# Altium project NixieClock_V1.PrjPCB
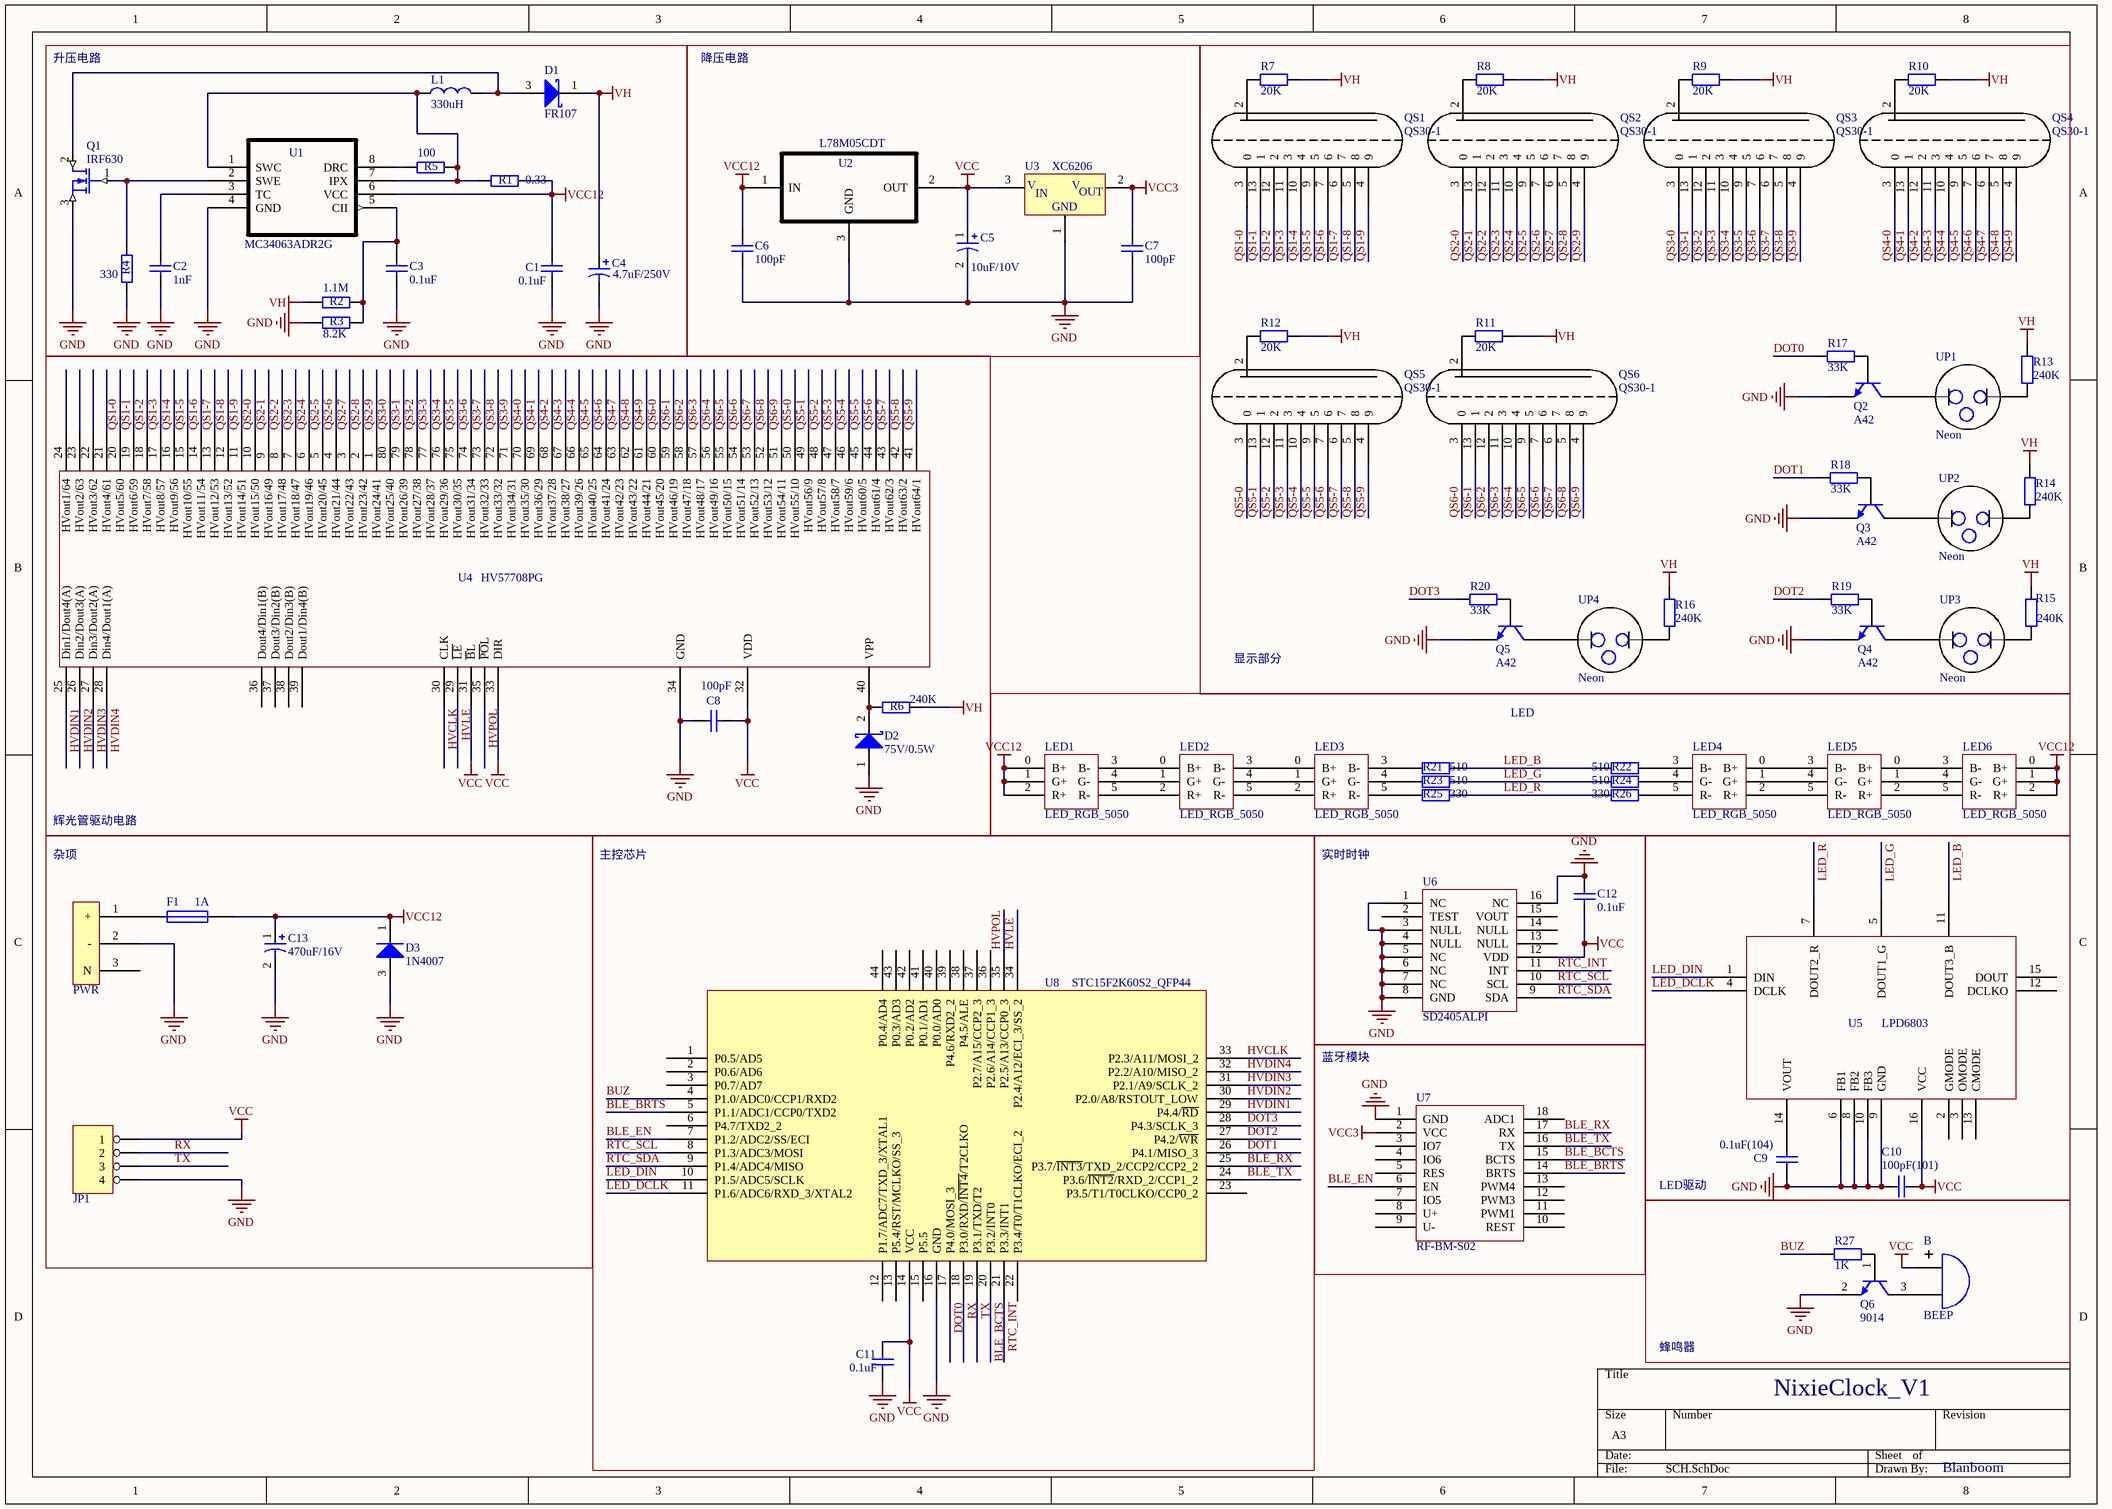
[diagram p0: SCH.SchDoc]
1 sheet, 78 parts. Net scope: global (net labels, ports and power ports of the same name join across sheets).
Board file: PCB.PcbDoc

## Sheet SCH.SchDoc
size A3; PageSetup: Record=PageOptions|CenterHorizontal=True|CenterVertical=True|PrintScale=1.00|XCorrection=1.00|YCorrection=1.00|PrintKind=1|BorderSize=5000000|LeftOffset=0|BottomOffset=0|Orientation=2|PaperLength=1000|PaperWidth=1000|Scale=100|PaperSource=7|PrintQuality=-4|MediaType=1|DitherType=10|PrintScaleMode=1|PaperKind=16K 197x273 mm|PaperIndex=121

### Parts
B  BEEP  [BEEP]
C1  value 0.1uF  [0805]  (hidden comment: Cap)
C2  value 1nF  [0805]  (hidden comment: Cap)
C3  value 0.1uF  [0805]  (hidden comment: Cap)
C4  value 4.7uF/250V  [1812]  (hidden comment: Cap Pol3)
C5  value 10uF/10V  [1206_Diode]  (hidden comment: Cap Pol1)
C6  value 100pF  [0805]  (hidden comment: Cap)
C7  value 100pF  [0805]  (hidden comment: Cap)
C8  value 100pF  [0805]  (hidden comment: Cap)
C9  value 0.1uF(104)  [0805]  (hidden comment: Cap)
C10  value 100pF(101)  [0805]  (hidden comment: Cap)
C11  value 0.1uF  [0805]  (hidden comment: Cap)
C12  value 0.1uF  [0805]  (hidden comment: Cap)
C13  value 470uF/16V  [7343]  (hidden comment: Cap Pol1)
D1  FR107  [DO-214AC]
D2  75V/0.5W  [1206_Diode]
D3  1N4007  [DO-214AC]
F1  1A  [1206]
JP1  Header4  [HEADER4]  (value not drawn)
L1  330uH  [330uH]
LED1  LED_RGB_5050  [LED_RGB_5050]
LED2  LED_RGB_5050  [LED_RGB_5050]
LED3  LED_RGB_5050  [LED_RGB_5050]
LED4  LED_RGB_5050  [LED_RGB_5050]
LED5  LED_RGB_5050  [LED_RGB_5050]
LED6  LED_RGB_5050  [LED_RGB_5050]
PWR  PWR  [DC-044]  (value not drawn)
Q1  IRF630  [TO-263]
Q2  A42  [SOT-23-BJT]
Q3  A42  [SOT-23-BJT]
Q4  A42  [SOT-23-BJT]
Q5  A42  [SOT-23-BJT]
Q6  9014  [SOT-23-BJT]
QS1  QS30-1  [QS30-1]
QS2  QS30-1  [QS30-1]
QS3  QS30-1  [QS30-1]
QS4  QS30-1  [QS30-1]
QS5  QS30-1  [QS30-1]
QS6  QS30-1  [QS30-1]
R1  value 0.33  [0805]  (hidden comment: Res2)
R2  value 1.1M  [0805]  (hidden comment: Res2)
R3  value 8.2K  [0805]  (hidden comment: Res2)
R4  value 330  [0805]  (hidden comment: Res2)
R5  value 100  [0805]  (hidden comment: Res2)
R6  value 240K  [0805]  (hidden comment: Res2)
R7  value 20K  [0805]  (hidden comment: Res2)
R8  value 20K  [0805]  (hidden comment: Res2)
R9  value 20K  [0805]  (hidden comment: Res2)
R10  value 20K  [0805]  (hidden comment: Res2)
R11  value 20K  [0805]  (hidden comment: Res2)
R12  value 20K  [0805]  (hidden comment: Res2)
R13  value 240K  [0805]  (hidden comment: Res2)
R14  value 240K  [0805]  (hidden comment: Res2)
R15  value 240K  [0805]  (hidden comment: Res2)
R16  value 240K  [0805]  (hidden comment: Res2)
R17  value 33K  [0805]  (hidden comment: Res2)
R18  value 33K  [0805]  (hidden comment: Res2)
R19  value 33K  [0805]  (hidden comment: Res2)
R20  value 33K  [0805]  (hidden comment: Res2)
R21  value 510  [0805]  (hidden comment: Res2)
R22  value 510  [0805]  (hidden comment: Res2)
R23  value 510  [0805]  (hidden comment: Res2)
R24  value 510  [0805]  (hidden comment: Res2)
R25  value 330  [0805]  (hidden comment: Res2)
R26  value 330  [0805]  (hidden comment: Res2)
R27  value 1K  [0805]  (hidden comment: Res2)
U1  MC34063ADR2G  [SO-8-M]
U2  L78M05CDT  [DPAK-M]
U3  XC6206  [SOT-23]
U4  HV57708PG  [PQFP80]
U5  LPD6803  [SO-16]
U6  SD2405ALPI  [DIP16]
U7  RF-BM-S02  [RF-BM-S02]
U8  STC15F2K60S2_QFP44  [LQFP44]
UP1  Neon  [Neon]
UP2  Neon  [Neon]
UP3  Neon  [Neon]
UP4  Neon  [Neon]

### Blocks framed on the sheet
升压电路: C1-C4 D1 L1 Q1 R1-R5 U1
降压电路: C5-C7 U2 U3
显示部分: Q2-Q5 QS1-QS6 R7-R20 UP1-UP4
辉光管驱动电路: C8 D2 R6 U4
LED: LED1-LED6 R21-R26
主控芯片: C11 U8
实时时钟: C12 U6
LED驱动: C9 C10 U5
蓝牙模块: U7

### Nets
GND: C1.1 C2.1 C3.1 C4.2 C5.2 C6.1 C7.1 C8.1 C9.1 C10.1 C11.2 C12.2 C13.2 D2.1(A) D3.3(A) JP1.4 PWR.2(-) Q1.3(S) Q2.2(E) Q3.2(E) Q4.2(E) Q5.2(E) Q6.2(E) R3.1 R4.1 U1.4(GND) U2.3(GND) U3.1(GND) U4.34(GND) U5.6(FB1) U5.8(FB2) U5.9(GND) U5.10(FB3) U6.1(NC) U6.3(NULL) U6.4(NULL) U6.5(NC) U6.6(NC) U6.7(NC) U6.8(GND) U6.16(NC) U7.1(GND) U8.16(GND)
VCC: B.1(A) C5.1 C8.2 C10.2 C11.1 C12.1 JP1.1 U2.2(OUT) U3.3(VIN) U4.31(~{B}L) U4.32(VDD) U4.33(DIR) U5.16(VCC) U6.12(VDD) U8.14(VCC)
VCC3: C7.2 U3.2(VOUT) U7.2(VCC)
VCC12: C1.2 C6.2 C13.1 D3.1(K) F1.2 LED1.0(B+) LED1.1(G+) LED1.2(R+) LED6.0(B+) LED6.1(G+) LED6.2(R+) R1.2 U1.6(VCC) U2.1(IN)
VH: C4.1 D1.1(K) R2.1 R6.2 R7.2 R8.2 R9.2 R10.2 R11.2 R12.2 R13.1 R14.1 R15.1 R16.1
BLE_BCTS: U7.15(BCTS) U8.20(P3.2/INT0)
BLE_BRTS: U7.14(BRTS) U8.5(P1.1/ADC1/CCP0/TXD2)
BLE_EN: U7.6(EN) U8.7(P1.2/ADC2/SS/ECI)
BLE_RX: U7.17(RX) U8.25(P3.7/~{INT3}/TXD_2/CCP2/CCP2_2)
BLE_TX: U7.16(TX) U8.24(P3.6/~{INT2}/RXD_2/CCP1_2)
BUZ: R27.1 U8.4(P1.0/ADC0/CCP1/RXD2)
DOT0: R17.1 U8.17(P4.0/MOSI_3)
DOT1: R18.1 U8.26(P4.1/MISO_3)
DOT2: R19.1 U8.27(P4.2/~{WR})
DOT3: R20.1 U8.28(P4.3/SCLK_3)
HVCLK: U4.30(CLK) U8.33(P2.3/A11/MOSI_2)
HVDIN1: U4.25(Din1/Dout4(A)) U8.29(P4.4/~{RD})
HVDIN2: U4.26(Din2/Dout3(A)) U8.30(P2.0/A8/RSTOUT_LOW)
HVDIN3: U4.27(Din3/Dout2(A)) U8.31(P2.1/A9/SCLK_2)
HVDIN4: U4.28(Din4/Dout1(A)) U8.32(P2.2/A10/MISO_2)
HVLE: U4.29(~{LE}) U8.34(P2.4/A12/ECI_3/SS_2)
HVPOL: U4.35(~{PO}L) U8.35(P2.5/A13/CCP0_3)
LED_B: R21.2 R22.1 U5.11(DOUT3_B)
LED_DCLK: U5.4(DCLK) U8.11(P1.6/ADC6/RXD_3/XTAL2)
LED_DIN: U5.1(DIN) U8.10(P1.5/ADC5/SCLK)
LED_G: R23.2 R24.1 U5.5(DOUT1_G)
LED_R: R25.2 R26.1 U5.7(DOUT2_R)
QS1-0: QS1.3(0) U4.20(HVout5/60)
QS1-1: QS1.13(1) U4.19(HVout6/59)
QS1-2: QS1.12(2) U4.18(HVout7/58)
QS1-3: QS1.11(3) U4.17(HVout8/57)
QS1-4: QS1.10(4) U4.16(HVout9/56)
QS1-5: QS1.9(5) U4.15(HVout10/55)
QS1-6: QS1.7(6) U4.14(HVout11/54)
QS1-7: QS1.6(7) U4.13(HVout12/53)
QS1-8: QS1.5(8) U4.12(HVout13/52)
QS1-9: QS1.4(9) U4.11(HVout14/51)
QS2-0: QS2.3(0) U4.10(HVout15/50)
QS2-1: QS2.13(1) U4.9(HVout16/49)
QS2-2: QS2.12(2) U4.8(HVout17/48)
QS2-3: QS2.11(3) U4.7(HVout18/47)
QS2-4: QS2.10(4) U4.6(HVout19/46)
QS2-5: QS2.9(5) U4.5(HVout20/45)
QS2-6: QS2.7(6) U4.4(HVout21/44)
QS2-7: QS2.6(7) U4.3(HVout22/43)
QS2-8: QS2.5(8) U4.2(HVout23/42)
QS2-9: QS2.4(9) U4.1(HVout24/41)
QS3-0: QS3.3(0) U4.80(HVout25/40)
QS3-1: QS3.13(1) U4.79(HVout26/39)
QS3-2: QS3.12(2) U4.78(HVout27/38)
QS3-3: QS3.11(3) U4.77(HVout28/37)
QS3-4: QS3.10(4) U4.76(HVout29/36)
QS3-5: QS3.9(5) U4.75(HVout30/35)
QS3-6: QS3.7(6) U4.74(HVout31/34)
QS3-7: QS3.6(7) U4.73(HVout32/33)
QS3-8: QS3.5(8) U4.72(HVout33/32)
QS3-9: QS3.4(9) U4.71(HVout34/31)
QS4-0: QS4.3(0) U4.70(HVout35/30)
QS4-1: QS4.13(1) U4.69(HVout36/29)
QS4-2: QS4.12(2) U4.68(HVout37/28)
QS4-3: QS4.11(3) U4.67(HVout38/27)
QS4-4: QS4.10(4) U4.66(HVout39/26)
QS4-5: QS4.9(5) U4.65(HVout40/25)
QS4-6: QS4.7(6) U4.64(HVout41/24)
QS4-7: QS4.6(7) U4.63(HVout42/23)
QS4-8: QS4.5(8) U4.62(HVout43/22)
QS4-9: QS4.4(9) U4.61(HVout44/21)
QS5-0: QS5.3(0) U4.50(HVout55/10)
QS5-1: QS5.13(1) U4.49(HVout56/9)
QS5-2: QS5.12(2) U4.48(HVout57/8)
QS5-3: QS5.11(3) U4.47(HVout58/7)
QS5-4: QS5.10(4) U4.46(HVout59/6)
QS5-5: QS5.9(5) U4.45(HVout60/5)
QS5-6: QS5.7(6) U4.44(HVout61/4)
QS5-7: QS5.6(7) U4.43(HVout62/3)
QS5-8: QS5.5(8) U4.42(HVout63/2)
QS5-9: QS5.4(9) U4.41(HVout64/1)
QS6-0: QS6.3(0) U4.60(HVout45/20)
QS6-1: QS6.13(1) U4.59(HVout46/19)
QS6-2: QS6.12(2) U4.58(HVout47/18)
QS6-3: QS6.11(3) U4.57(HVout48/17)
QS6-4: QS6.10(4) U4.56(HVout49/16)
QS6-5: QS6.9(5) U4.55(HVout50/15)
QS6-6: QS6.7(6) U4.54(HVout51/14)
QS6-7: QS6.6(7) U4.53(HVout52/13)
QS6-8: QS6.5(8) U4.52(HVout53/12)
QS6-9: QS6.4(9) U4.51(HVout54/11)
RTC_INT: U6.11(INT) U8.21(P3.3/INT1)
RTC_SCL: U6.10(SCL) U8.8(P1.3/ADC3/MOSI)
RTC_SDA: U6.9(SDA) U8.9(P1.4/ADC4/MISO)
RX: JP1.2 U8.18(P3.0/RXD/~{INT4}/T2CLKO)
TX: JP1.3 U8.19(P3.1/TXD/T2)
NetB_2: B.2(B) Q6.3(C)
NetC2_2: C2.2 U1.3(TC)
NetC3_2: C3.2 R2.2 R3.2 U1.5(CII)
NetC9_2: C9.2 U5.14(VOUT)
NetD1_3: D1.3(A) L1.1 Q1.2(D)
NetD2_2: D2.2(K) R6.1 U4.40(VPP)
NetF1_1: F1.1 PWR.1(+)
NetL1_2: L1.2 R1.1 R5.1 U1.1(SWC) U1.7(IPX)
NetLED1_3: LED1.3(B-) LED2.0(B+)
NetLED1_4: LED1.4(G-) LED2.1(G+)
NetLED1_5: LED1.5(R-) LED2.2(R+)
NetLED2_3: LED2.3(B-) LED3.0(B+)
NetLED2_4: LED2.4(G-) LED3.1(G+)
NetLED2_5: LED2.5(R-) LED3.2(R+)
NetLED3_3: LED3.3(B-) R21.1
NetLED3_4: LED3.4(G-) R23.1
NetLED3_5: LED3.5(R-) R25.1
NetLED4_0: LED4.0(B+) LED5.3(B-)
NetLED4_1: LED4.1(G+) LED5.4(G-)
NetLED4_2: LED4.2(R+) LED5.5(R-)
NetLED4_3: LED4.3(B-) R22.2
NetLED4_4: LED4.4(G-) R24.2
NetLED4_5: LED4.5(R-) R26.2
NetLED5_0: LED5.0(B+) LED6.3(B-)
NetLED5_1: LED5.1(G+) LED6.4(G-)
NetLED5_2: LED5.2(R+) LED6.5(R-)
NetQ1_1: Q1.1(G) R4.2 U1.2(SWE)
NetQ2_1: Q2.1(B) R17.2
NetQ2_3: Q2.3(C) UP1.2
NetQ3_1: Q3.1(B) R18.2
NetQ3_3: Q3.3(C) UP2.2
NetQ4_1: Q4.1(B) R19.2
NetQ4_3: Q4.3(C) UP3.2
NetQ5_1: Q5.1(B) R20.2
NetQ5_3: Q5.3(C) UP4.2
NetQ6_1: Q6.1(B) R27.2
NetQS1_2: QS1.2 R7.1
NetQS2_2: QS2.2 R8.1
NetQS3_2: QS3.2 R9.1
NetQS4_2: QS4.2 R10.1
NetQS5_2: QS5.2 R12.1
NetQS6_2: QS6.2 R11.1
NetR5_2: R5.2 U1.8(DRC)
NetR13_2: R13.2 UP1.1
NetR14_2: R14.2 UP2.1
NetR15_2: R15.2 UP3.1
NetR16_2: R16.2 UP4.1

Not connected (* = marked no-connect by the designer): PWR 3(N); U4 21(HVout4/61) 22(HVout3/62) 23(HVout2/63) 24(HVout1/64) 36(Dout4/Din1(B)) 37(Dout3/Din2(B)) 38(Dout2/Din3(B)) 39(Dout1/Din4(B)); U5 2(GMODE) 3(OMODE) 12(DCLKO) 13(CMODE) 15(DOUT); U6 2(TEST) 13(NULL) 14(NULL) 15(VOUT); U7 3(IO7) 4(IO6) 5(RES) 7(IO5) 8(U+) 9(U-) 10(REST) 11(PWM1) 12(PWM3) 13(PWM4) 18(ADC1); U8 1(P0.5/AD5) 2(P0.6/AD6) 3(P0.7/AD7) 6(P4.7/TXD2_2) 12(P1.7/ADC7/TXD_3/XTAL1) 13(P5.4/RST/MCLKO/SS_3) 15(P5.5) 22(P3.4/T0/T1CLKO/ECI_2) 23(P3.5/T1/T0CLKO/CCP0_2) 36(P2.6/A14/CCP1_3) 37(P2.7/A15/CCP2_3) 38(P4.5/ALE) 39(P4.6/RXD2_2) 40(P0.0/AD0) 41(P0.1/AD1) 42(P0.2/AD2) 43(P0.3/AD3) 44(P0.4/AD4)

### Notes on the sheet
- 杂项
- 蜂鸣器
- NixieClock_V1
- Blanboom
- (in symbol XC6206) V; IN; OUT

### Library data of the parts
C1-C3 C6-C12 = Cap: Capacitor; Published: 8-Jun-2000; LatestRevisionDate: 17-Jul-2002; LatestRevisionNote: Re-released for DXP Platform.; PackageReference: RAD-0.3; Publisher: Altium Limited; PackageDescription: Radial Cap, Thru-Hole; 2 Leads; 0.3 in Pin Spacing
C4 = Cap Pol3: Polarized Capacitor (Surface Mount); Published: 8-Jun-2000; LatestRevisionDate: 29-May-2009; LatestRevisionNote: IPC-7351 Footprint Added.; PackageReference: C0805; Publisher: Altium Limited; PackageDescription: Chip Capacitor
C5 C13 = Cap Pol1: Polarized Capacitor (Radial); Published: 8-Jun-2000; LatestRevisionDate: 17-Jul-2002; LatestRevisionNote: Re-released for DXP Platform.; PackageReference: RB7.6-15; Publisher: Altium Limited; PackageDescription: Polarized Capacitor (Radial); 2 Leads
D1 = Diode 18TQ045: Schottky Rectifier; Note: Terminal 2 is the TAB and is electrically connected to the cathode; Published: 8-Jun-2000; LatestRevisionDate: 17-Jul-2002; LatestRevisionNote: Re-released for DXP Platform.; DatasheetVersion: Dec-1997; PackageVersion: Feb-1998; PackageReference: TO-220AC; Publisher: Altium Limited; PackageDescription: TO, Thru-Hole, Vertical, Heatsink Mounted; 3 In-Line Leads (1 Absent); Pitch 2.54 mm; ComponentLink1Description: Manufacturer Link; ComponentLink1URL: http://www.irf.com/; ComponentLink2Description: Datasheet; ComponentLink2URL: http://www.irf.com/product-info/datasheets/data/18tq.pdf
D2 = Diode 10TQ040: Schottky Rectifier; Note: Terminal 2 is the TAB and is electrically connected to the cathode; Published: 8-Jun-2000; LatestRevisionDate: 17-Jul-2002; LatestRevisionNote: Re-released for DXP Platform.; DatasheetVersion: PD-2.057B; PackageVersion: Feb-1998; PackageReference: TO-220AC; Publisher: Altium Limited; PackageDescription: TO, Thru-Hole, Vertical, Heatsink Mounted; 3 In-Line Leads (1 Absent); Pitch 2.54 mm; ComponentLink1Description: Manufacturer Link; ComponentLink1URL: http://www.irf.com/
D3 = Diode: Default Diode; Published: 8-Jun-2000; LatestRevisionDate: 17-Jul-2002; LatestRevisionNote: Re-released for DXP Platform.; PackageVersion: Sep-1996; PackageReference: SMC; Publisher: Altium Limited; PackageDescription: DO-214-AB/SMC; 2 C-Bend Leads; Body 7.9 x 5.9 mm, inc. leads (LxW); Code_JEDEC: DO-214-AB
F1 = Fuse 1: Fuse; Published: 8-Jun-2000; LatestRevisionDate: 17-Jul-2002; LatestRevisionNote: Re-released for DXP Platform.; PackageReference: PIN-W2/E2.8; Publisher: Altium Limited; PackageDescription: Thru-Hole; 2 Leads
JP1 = 4 HEADER: 4 Pin Header
L1 = L
PWR = header2
Q1 = IRF630: N-Channel MOSFET
Q2-Q6 = 2N3904: NPN General Purpose Amplifier; Published: 8-Jun-2000; LatestRevisionDate: 15-Jan-2003; LatestRevisionNote: PCB Footprint 'BCY-W3/D4.7' replaced; DatasheetVersion: 1997; PackageVersion: Sep-1998; PackageReference: TO-92A; Publisher: Altium Limited; PackageDescription: TO, Flat Index; 3 In-Line, Axial Leads; Body Dia. 4.5mm; Leads 0.51 x 0.48 mm (max); ComponentLink1Description: Manufacturer Link; ComponentLink1URL: http://www.fairchildsemi.com/; ComponentLink2Description: Datasheet; ComponentLink2URL: http://www.fairchildsemi.com/ds/2N%2F2N3904.pdf
R1-R27 = Res2: Resistor; Published: 8-Jun-2000; LatestRevisionDate: 17-Jul-2002; LatestRevisionNote: Re-released for DXP Platform.; PackageReference: AXIAL-0.4; Publisher: Altium Limited; PackageDescription: Axial Device, Thru-Hole; 2 Leads; 0.4 in Pin Spacing
U1 = MC34063ACD-TR: Imported; Manufacturer_Part_Number: MC34063ADR2G
U2 = L78M05CDT: Imported
U3 = XC6206: 3-Terminal Positive Voltage Regulator